# Altium schematic sheet pds.SchDoc: GECKO3main PDS simulation
size A4; Organization: Berne University of Applied Science; Address1: Quellgasse 21; Address2: CH-2501 Biel/Bienne; Address3: Switzerland; Revision: 1; SheetNumber: 2; SheetTotal: 2; Author: zac1; DrawnBy: zac1
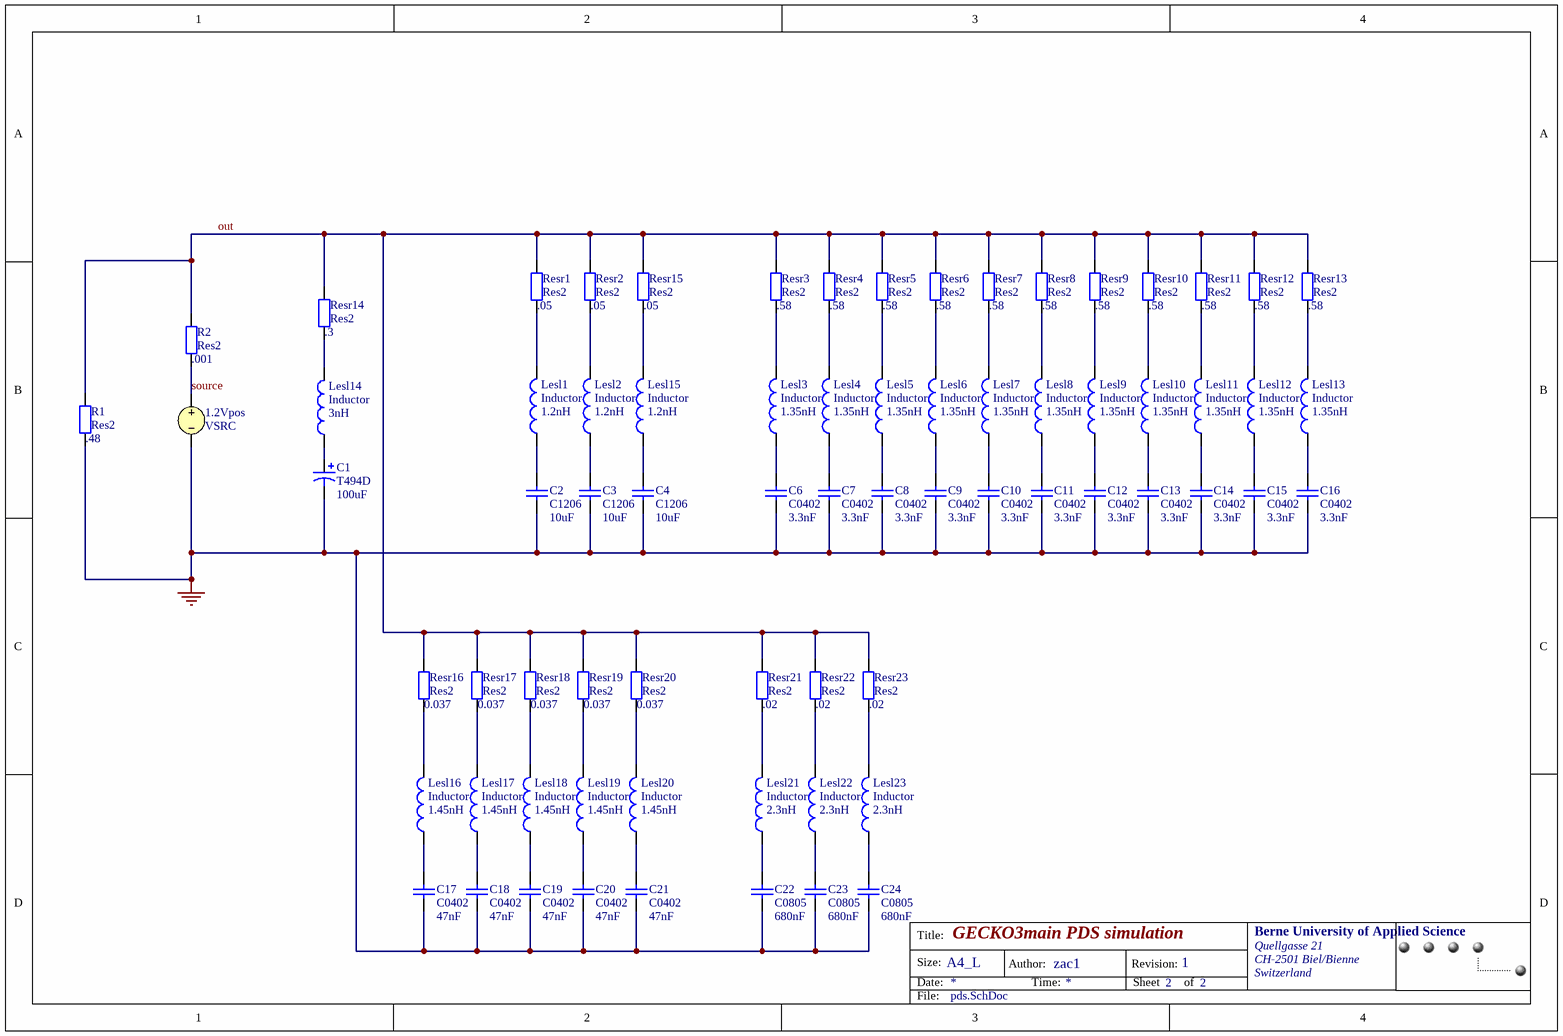
[diagram p0: pds.SchDoc]

## Parts
1.2Vpos  VSRC
?  CC License  [CC-License]  (value not drawn)
C1  T494D  value 100uF  [D]
C2  C1206  value 10uF  [1206]
C3  C1206  value 10uF  [1206]
C4  C1206  value 10uF  [1206]
C6  C0402  value 3.3nF  [0402]
C7  C0402  value 3.3nF  [0402]
C8  C0402  value 3.3nF  [0402]
C9  C0402  value 3.3nF  [0402]
C10  C0402  value 3.3nF  [0402]
C11  C0402  value 3.3nF  [0402]
C12  C0402  value 3.3nF  [0402]
C13  C0402  value 3.3nF  [0402]
C14  C0402  value 3.3nF  [0402]
C15  C0402  value 3.3nF  [0402]
C16  C0402  value 3.3nF  [0402]
C17  C0402  value 47nF  [0402]
C18  C0402  value 47nF  [0402]
C19  C0402  value 47nF  [0402]
C20  C0402  value 47nF  [0402]
C21  C0402  value 47nF  [0402]
C22  C0805  value 680nF  [0805]
C23  C0805  value 680nF  [0805]
C24  C0805  value 680nF  [0805]
Lesl1  Inductor  value 1.2nH  [INDC1005-0402]
Lesl2  Inductor  value 1.2nH  [INDC1005-0402]
Lesl3  Inductor  value 1.35nH  [INDC1005-0402]
Lesl4  Inductor  value 1.35nH  [INDC1005-0402]
Lesl5  Inductor  value 1.35nH  [INDC1005-0402]
Lesl6  Inductor  value 1.35nH  [INDC1005-0402]
Lesl7  Inductor  value 1.35nH  [INDC1005-0402]
Lesl8  Inductor  value 1.35nH  [INDC1005-0402]
Lesl9  Inductor  value 1.35nH  [INDC1005-0402]
Lesl10  Inductor  value 1.35nH  [INDC1005-0402]
Lesl11  Inductor  value 1.35nH  [INDC1005-0402]
Lesl12  Inductor  value 1.35nH  [INDC1005-0402]
Lesl13  Inductor  value 1.35nH  [INDC1005-0402]
Lesl14  Inductor  value 3nH  [INDC1005-0402]
Lesl15  Inductor  value 1.2nH  [INDC1005-0402]
Lesl16  Inductor  value 1.45nH  [INDC1005-0402]
Lesl17  Inductor  value 1.45nH  [INDC1005-0402]
Lesl18  Inductor  value 1.45nH  [INDC1005-0402]
Lesl19  Inductor  value 1.45nH  [INDC1005-0402]
Lesl20  Inductor  value 1.45nH  [INDC1005-0402]
Lesl21  Inductor  value 2.3nH  [INDC1005-0402]
Lesl22  Inductor  value 2.3nH  [INDC1005-0402]
Lesl23  Inductor  value 2.3nH  [INDC1005-0402]
R1  Res2  value .48  [AXIAL-0.4]
R2  Res2  value .001  [AXIAL-0.4]
Resr1  Res2  value .05  [AXIAL-0.4]
Resr2  Res2  value .05  [AXIAL-0.4]
Resr3  Res2  value .58  [AXIAL-0.4]
Resr4  Res2  value .58  [AXIAL-0.4]
Resr5  Res2  value .58  [AXIAL-0.4]
Resr6  Res2  value .58  [AXIAL-0.4]
Resr7  Res2  value .58  [AXIAL-0.4]
Resr8  Res2  value .58  [AXIAL-0.4]
Resr9  Res2  value .58  [AXIAL-0.4]
Resr10  Res2  value .58  [AXIAL-0.4]
Resr11  Res2  value .58  [AXIAL-0.4]
Resr12  Res2  value .58  [AXIAL-0.4]
Resr13  Res2  value .58  [AXIAL-0.4]
Resr14  Res2  value .3  [AXIAL-0.4]
Resr15  Res2  value .05  [AXIAL-0.4]
Resr16  Res2  value 0.037  [AXIAL-0.4]
Resr17  Res2  value 0.037  [AXIAL-0.4]
Resr18  Res2  value 0.037  [AXIAL-0.4]
Resr19  Res2  value 0.037  [AXIAL-0.4]
Resr20  Res2  value 0.037  [AXIAL-0.4]
Resr21  Res2  value .02  [AXIAL-0.4]
Resr22  Res2  value .02  [AXIAL-0.4]
Resr23  Res2  value .02  [AXIAL-0.4]

## Nets
GND: 1.2Vpos.2 C1.2 C2.1 C3.1 C4.1 C6.1 C7.1 C8.1 C9.1 C10.1 C11.1 C12.1 C13.1 C14.1 C15.1 C16.1 C17.1 C18.1 C19.1 C20.1 C21.1 C22.1 C23.1 C24.1 R1.1
out: R1.2 R2.2 Resr1.2 Resr2.2 Resr3.2 Resr4.2 Resr5.2 Resr6.2 Resr7.2 Resr8.2 Resr9.2 Resr10.2 Resr11.2 Resr12.2 Resr13.2 Resr14.2 Resr15.2 Resr16.2 Resr17.2 Resr18.2 Resr19.2 Resr20.2 Resr21.2 Resr22.2 Resr23.2
source: 1.2Vpos.1 R2.1
NetC1_1: C1.1 Lesl14.1
NetC2_2: C2.2 Lesl1.1
NetC3_2: C3.2 Lesl2.1
NetC4_2: C4.2 Lesl15.1
NetC6_2: C6.2 Lesl3.1
NetC7_2: C7.2 Lesl4.1
NetC8_2: C8.2 Lesl5.1
NetC9_2: C9.2 Lesl6.1
NetC10_2: C10.2 Lesl7.1
NetC11_2: C11.2 Lesl8.1
NetC12_2: C12.2 Lesl9.1
NetC13_2: C13.2 Lesl10.1
NetC14_2: C14.2 Lesl11.1
NetC15_2: C15.2 Lesl12.1
NetC16_2: C16.2 Lesl13.1
NetC17_2: C17.2 Lesl16.1
NetC18_2: C18.2 Lesl17.1
NetC19_2: C19.2 Lesl18.1
NetC20_2: C20.2 Lesl19.1
NetC21_2: C21.2 Lesl20.1
NetC22_2: C22.2 Lesl21.1
NetC23_2: C23.2 Lesl22.1
NetC24_2: C24.2 Lesl23.1
NetLesl1_2: Lesl1.2 Resr1.1
NetLesl2_2: Lesl2.2 Resr2.1
NetLesl3_2: Lesl3.2 Resr3.1
NetLesl4_2: Lesl4.2 Resr4.1
NetLesl5_2: Lesl5.2 Resr5.1
NetLesl6_2: Lesl6.2 Resr6.1
NetLesl7_2: Lesl7.2 Resr7.1
NetLesl8_2: Lesl8.2 Resr8.1
NetLesl9_2: Lesl9.2 Resr9.1
NetLesl10_2: Lesl10.2 Resr10.1
NetLesl11_2: Lesl11.2 Resr11.1
NetLesl12_2: Lesl12.2 Resr12.1
NetLesl13_2: Lesl13.2 Resr13.1
NetLesl14_2: Lesl14.2 Resr14.1
NetLesl15_2: Lesl15.2 Resr15.1
NetLesl16_2: Lesl16.2 Resr16.1
NetLesl17_2: Lesl17.2 Resr17.1
NetLesl18_2: Lesl18.2 Resr18.1
NetLesl19_2: Lesl19.2 Resr19.1
NetLesl20_2: Lesl20.2 Resr20.1
NetLesl21_2: Lesl21.2 Resr21.1
NetLesl22_2: Lesl22.2 Resr22.1
NetLesl23_2: Lesl23.2 Resr23.1

## Notes on the sheet
- Title:
- Size:
- Date:
- A4_L
- Author:
- Time:
- Revision:
- Sheet
- of
- File:

## Library data of the parts
1.2Vpos = VSRC: Voltage Source; Note: PCB Footprint - Not required; Value: +1.2; Published: 8-Jun-2000; LatestRevisionDate: 17-Jul-2002; LatestRevisionNote: Re-released for DXP Platform.; PackageReference: Not Applicable; Publisher: Altium Limited
C1 = T494D: Solid Tantalum Chip Capacitor, Standard T494 Series - Low ESR, Industrial Grade; Published: 17-Jul-2002; LatestRevisionDate: 19-Mar-2004; LatestRevisionNote: Silkscreen dimensions re-sized.; DatasheetDocument: Mar-2001; PackageDocument: Mar-2001; PackageReference: D; Publisher: Altium Limited; Code_JEITA: 7343-31; ComponentLink1Description: Manufacturer Link; ComponentLink1URL: http://www.kemet.com/; ComponentLink2Description: Datasheet; ComponentLink2URL: http://www.kemet.com/kemet/web/homepage/kechome.nsf/vapubfilesname/F3102TA.pdf/$file/F3102TA.pdf
C2-C4 = C1206: Ceramic Chip Capacitor - Standard; Published: 17-Jul-2002; LatestRevisionDate: 19-Mar-2004; LatestRevisionNote: Silkscreen size reduced.; DatasheetDocument: Mar-2001; PackageDocument: Mar-2001; PackageReference: 1206; Publisher: Altium Limited; Code_JEITA: 1206; Code_IPC: 3216 [1206]; ComponentLink1Description: Manufacturer Link; ComponentLink1URL: http://www.kemet.com/; ComponentLink2Description: Datasheet; ComponentLink2URL: http://www.kemet.com/kemet/web/homepage/kechome.nsf/vapubfilesname/F3102TA.pdf/$file/F3102TA.pdf
C6-C21 = C0402: Ceramic Chip Capacitor - Standard; Note: Footprint corresponds to dimensions for bulk cassette packaging. This case size has tightened tolerances.; Published: 17-Jul-2002; LatestRevisionDate: 19-Mar-2004; LatestRevisionNote: Silkscreen size reduced.; DatasheetDocument: Mar-2001; PackageDocument: Mar-2001; PackageReference: 0402; Publisher: Altium Limited; Code_JEITA: 0402; Code_IPC: 1005 [0402]; ComponentLink1Description: Manufacturer Link; ComponentLink1URL: http://www.kemet.com/; ComponentLink2Description: Datasheet; ComponentLink2URL: http://www.kemet.com/kemet/web/homepage/kechome.nsf/vapubfilesname/F3102TA.pdf/$file/F3102TA.pdf
C22-C24 = C0805: Ceramic Chip Capacitor - Standard; Note: Footprint corresponds to dimensions for bulk cassette packaging. This case size has tightened tolerances.; Published: 17-Jul-2002; LatestRevisionDate: 19-Mar-2004; LatestRevisionNote: Silkscreen size reduced.; DatasheetDocument: Mar-2001; PackageDocument: Mar-2001; PackageReference: 0805; Publisher: Altium Limited; Code_JEITA: 0805; Code_IPC: 2012[0805]; ComponentLink1Description: Manufacturer Link; ComponentLink1URL: http://www.kemet.com/; ComponentLink2Description: Datasheet; ComponentLink2URL: http://www.kemet.com/kemet/web/homepage/kechome.nsf/vapubfilesname/F3102TA.pdf/$file/F3102TA.pdf
Lesl1-Lesl23 = Inductor: Code_IEC: 1005; Published: 8-Jun-2000; LatestRevisionDate: 17-Jul-2002; LatestRevisionNote: Re-released for DXP Platform.; PackageReference: 0402-A; Publisher: Altium Limited; Code_JEITA: 0402
R1 R2 Resr1-Resr23 = Res2: Resistor; Published: 8-Jun-2000; LatestRevisionDate: 17-Jul-2002; LatestRevisionNote: Re-released for DXP Platform.; Publisher: Altium Limited